# Altium schematic sheet power.SchDoc
size A
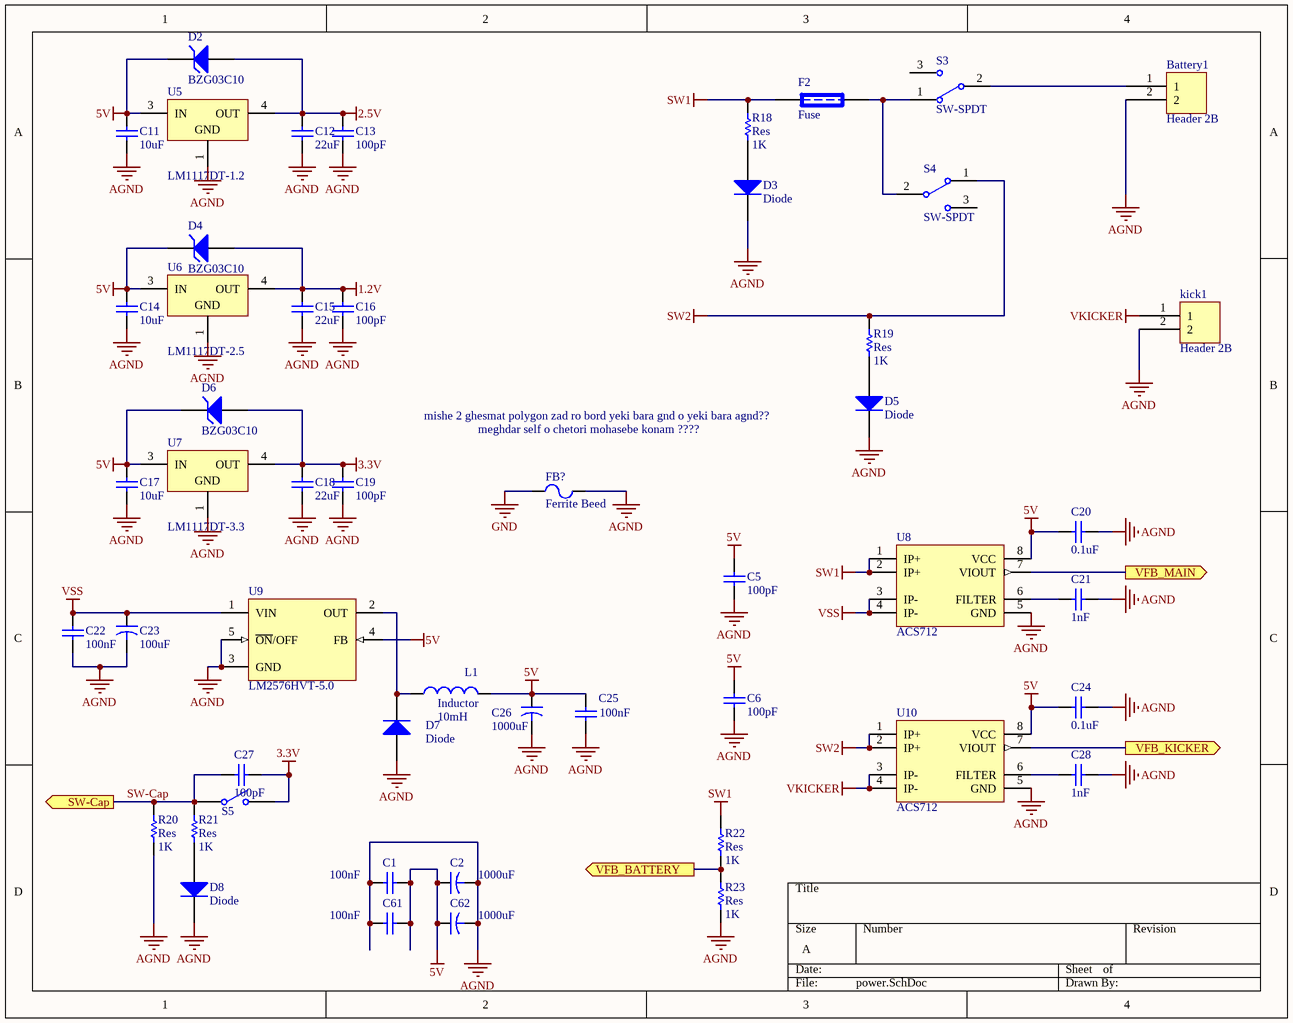
[diagram p0: power.SchDoc]

## Parts
Battery1  Header 2B  [BHDR1X2]
C1  value 100nF  [2012[0805]]  (hidden comment: Cap_UP)
C2  value 1000uF  [7343]  (hidden comment: Cap_El)
C5  value 100pF  [2012[0805]]  (hidden comment: Cap_UP)
C6  value 100pF  [2012[0805]]  (hidden comment: Cap_UP)
C11  value 10uF  [2012[0805]]  (hidden comment: Cap_UP)
C12  value 22uF  [2012[0805]]  (hidden comment: Cap_UP)
C13  value 100pF  [2012[0805]]  (hidden comment: Cap_UP)
C14  value 10uF  [2012[0805]]  (hidden comment: Cap_UP)
C15  value 22uF  [2012[0805]]  (hidden comment: Cap_UP)
C16  value 100pF  [2012[0805]]  (hidden comment: Cap_UP)
C17  value 10uF  [2012[0805]]  (hidden comment: Cap_UP)
C18  value 22uF  [2012[0805]]  (hidden comment: Cap_UP)
C19  value 100pF  [2012[0805]]  (hidden comment: Cap_UP)
C20  value 0.1uF  [2012[0805]]  (hidden comment: Cap_UP)
C21  value 1nF  [2012[0805]]  (hidden comment: Cap_UP)
C22  value 100nF  [2012[0805]]  (hidden comment: Cap_UP)
C23  value 100uF  [Cap1000u-16]  (hidden comment: Cap_El)
C24  value 0.1uF  [2012[0805]]  (hidden comment: Cap_UP)
C25  value 100nF  [2012[0805]]  (hidden comment: Cap_UP)
C26  value 1000uF  [7343]  (hidden comment: Cap_El)
C27  value 100pF  [2012[0805]]  (hidden comment: Cap_UP)
C28  value 1nF  [2012[0805]]  (hidden comment: Cap_UP)
C61  value 100nF  [2012[0805]]  (hidden comment: Cap_UP)
C62  value 1000uF  [7343]  (hidden comment: Cap_El)
D2  BZG03C10  [DO214]
D3  Diode  [2012[0805]]
D4  BZG03C10  [DO214]
D5  Diode  [2012[0805]]
D6  BZG03C10  [DO214]
D7  Diode  [US1M]
D8  Diode  [2012[0805]]
F2  Fuse  [fuse kh]
FB?  Ferrite Beed  [7343]
kick1  Header 2B  [BHDR1X2]
L1  Inductor  value 10mH  [inductor]
R18  Res  value 1K  [2012[0805]]
R19  Res  value 1K  [2012[0805]]
R20  Res  value 1K  [2012[0805]]
R21  Res  value 1K  [2012[0805]]
R22  Res  value 1K  [2012[0805]]
R23  Res  value 1K  [2012[0805]]
S3  SW-SPDT  [KEYKHRAB]
S4  SW-SPDT  [KEYKHRAB]
S5  SW-SPST  [push button B]  (value not drawn)
U5  LM1117DT-1.2  [SOT223]
U6  LM1117DT-2.5  [SOT223]
U7  LM1117DT-3.3  [SOT223]
U8  ACS712  [8 pin SOIC_N]
U9  LM2576HVT-5.0  [T05A]
U10  ACS712  [8 pin SOIC_N]

## Ports
SW-Cap (out), VFB_BATTERY (out), VFB_KICKER (out), VFB_MAIN (out)

## Nets
1.2V: C15.2 C16.2 D4.1(A) U6.4(OUT)
2.5V: C12.2 C13.2 D2.1(A) U5.4(OUT)
3.3V: C18.2 C19.2 C27.2 D6.1(A) S5.2(NO) U7.4(OUT)
5V: C1.2 C2.1 C5.2 C6.2 C11.2 C14.2 C17.2 C20.1 C24.1 C25.2 C26.1 C61.2 C62.1 D2.2(K) D4.2(K) D6.2(K) L1.2 U5.3(IN) U6.3(IN) U7.3(IN) U8.8(VCC) U9.4(FB) U10.8(VCC)
AGND: Battery1.2 C1.1 C2.2 C5.1 C6.1 C11.1 C12.1 C13.1 C14.1 C15.1 C16.1 C17.1 C18.1 C19.1 C20.2 C21.2 C22.1 C23.2 C24.2 C25.1 C26.2 C28.2 C61.1 C62.2 D3.2(K) D5.2(K) D7.1(A) D8.2(K) FB?.2 kick1.2 R20.1 R23.1 U5.1(GND) U6.1(GND) U7.1(GND) U8.5(GND) U9.3(GND) U9.5(~{ON}/OFF) U10.5(GND)
GND: FB?.1
SW1: F2.1 R18.2 R22.2 U8.1(IP+) U8.2(IP+)
SW2: R19.2 S4.1 U10.1(IP+) U10.2(IP+)
VKICKER: kick1.1 U10.3(IP-) U10.4(IP-)
VSS: C22.2 C23.1 U8.3(IP-) U8.4(IP-) U9.1(VIN)
SW-Cap: C27.1 R20.2 R21.2 S5.1(COMMON) ; port SW-Cap
VFB_BATTERY: R22.1 R23.2 ; port VFB_BATTERY
VFB_KICKER: U10.7(VIOUT) ; port VFB_KICKER
VFB_MAIN: U8.7(VIOUT) ; port VFB_MAIN
NetBattery1_1: Battery1.1 S3.2
NetC21_1: C21.1 U8.6(FILTER)
NetC28_1: C28.1 U10.6(FILTER)
NetD3_1: D3.1(A) R18.1
NetD5_1: D5.1(A) R19.1
NetD7_2: D7.2(K) L1.1 U9.2(OUT)
NetD8_1: D8.1(A) R21.1
NetF2_2: F2.2 S3.1 S4.2

Not connected (* = marked no-connect by the designer): S3 3(1); S4 3(1)

## Notes on the sheet
- (near D5) mishe 2 ghesmat polygon zad ro bord yeki bara gnd o yeki bara agnd??
- meghdar self o chetori mohasebe konam ????

## Library data of the parts
C1 C5 C6 C11-C22 C24 C25 C27 C28 C61 = Cap_UP: Capacitor; Published: 8-Jun-2000; LatestRevisionDate: 17-Jul-2002; LatestRevisionNote: Re-released for DXP Platform.; PackageReference: RAD-0.3; Publisher: Altium Limited
C2 C23 C26 C62 = Cap_El: Capacitor; Published: 23-Sep-2002; PackageReference: CAPR5-4X5; Publisher: Altium Limited
D2 D4 D6 = BZG03C10: Silicon Zener Diode (3W); Published: 8-Jun-2000; LatestRevisionDate: 17-Jul-2002; LatestRevisionNote: Re-released for DXP Platform.; DatasheetDocument: 1-Apr-1999; PackageDocument: Apr-1999; PackageReference: DO214; Publisher: Altium Limited; ComponentLink1Description: Manufacturer Link; ComponentLink1URL: http://www.vishay.com/; ComponentLink2Description: Datasheet; ComponentLink2URL: http://www.vishay.com/docs/85593/85593.pdf
D3 D5 D7 D8 = Diode: 1 Amp General Purpose Rectifier; Revision 1: 11-Jul-2000: SIM Model Added.; Revision 2: 17-Jul-2002: Re-released for DXP Platform.; Package Information: Latest Revision: Aug-1999; Code - JEDEC: DO-204-AL; Published: 8-Jun-2000; Datasheet: Latest Revision: 1998; Package Reference: DO-41; Publisher: Altium Limited
FB? = Ferrite Beed: Code_IEC: 1005; Published: 8-Jun-2000; LatestRevisionDate: 17-Jul-2002; LatestRevisionNote: Re-released for DXP Platform.; PackageReference: 0402-A; Publisher: Altium Limited; Code_JEITA: 0402
L1 = Inductor: Code_IEC: 1005; Published: 8-Jun-2000; LatestRevisionDate: 17-Jul-2002; LatestRevisionNote: Re-released for DXP Platform.; PackageReference: 0402-A; Publisher: Altium Limited; Code_JEITA: 0402
R18-R23 = Res: Semiconductor Resistor; Published: 8-Jun-2000; LatestRevisionDate: 17-Jul-2002; LatestRevisionNote: Re-released for DXP Platform.; PackageReference: AXIAL-0.5; Publisher: Altium Limited
S3 S4 = SW-SPDT: SPDT Subminiature Toggle Switch, Right Angle Mounting, Vertical Actuation; Published: 24-Mar-1999; LatestRevisionDate: 17-Dec-2003; LatestRevisionNote: Schematic revised, PCB Footprint replaced.; DatasheetDocument: 05-Dec-2000; PackageReference: TL36WW15050; Publisher: Altium Limited; ComponentLink1Description: Manufacturer Link; ComponentLink1URL: http://www.apem.com
S5 = SW-SPST: Single-Pole, Single-Throw Switch; Published: 24-Mar-1999; Revision: July-2002: Re-released for DXP Platform.; Publisher: Altium Limited
U5-U7 = LM1117DT-3.3: 800mA Low-Dropout Linear Regulator, 3-pin TO-252; Manufacturer: National Semiconductor; PackageTopMarking: NSUZXYTT*LM1117*DT-3.3; PowerWise: N; CompType: LDO IC; Published: 4-Dec-2008; DatasheetVersion: Apr-2006; PackageVersion: revD, Feb-2009; PackageReference: TD03B; Publisher: Altium Limited; PackageDescription: TO252, Molded, Jedec, 6.8 x 6.10 x 2.30mm Body, 3 Lead, 2.28mm Pitch, Surface Mount; Supplier 1: Farnell; Supplier Part Number 1: 9486275; Supplier 2: Farnell; Supplier Part Number 2: 1523829; PartNumber: LM1117DT-3.3; RoHS: N; PinCount: 3; Code_JEDEC: TO-252-AA; ComponentLink1Description: LM1117 Datasheet; ComponentLink1URL: http://www.national.com/ds/LM/LM1117.pdf; ComponentLink2Description: LM1117 Web Page; ComponentLink2URL: http://www.national.com/pf/LM/LM1117.html; ComponentLink3Description: TD03B Package Page; ComponentLink3URL: http://www.national.com/packaging/folders/td03b.html
U9 = LM2576HVT-5.0: SIMPLE SWITCHER; 3A Step-Down Voltage Regulator; Manufacturer: National Semiconductor; PackageTopMarking: NSUZXYTT*LM2576HVT*-5.0 P+; Published: 27-Nov-2008; DatasheetVersion: Aug-2004; PackageVersion: revJ, Jan-1992; PackageReference: T05A; Publisher: Altium Limited; PackageDescription: TO-220, Molded, 5 Lead, Straight; CompType: Switcher; PartNumber: LM2576HVT-5.0; RoHS: O; PinCount: 5; DigiKeyPartNumber: LM2576HVT-5.0-ND; Code_JEDEC: TO-220-AB; ComponentLink1Description: LM2576HV Datasheet; ComponentLink1URL: http://www.national.com/ds/LM/LM2576HV.pdf; ComponentLink2Description: LM2576HV Web Page; ComponentLink2URL: http://www.national.com/pf/LM/LM2576HV.html; ComponentLink3Description: T05A Package Page; ComponentLink3URL: http://www.national.com/packaging/folders/t05a.html
F2 = Fuse: Published: 8-Jun-2000; LatestRevisionDate: 17-Jul-2002; LatestRevisionNote: Re-released for DXP Platform.; PackageReference: PIN-W2/E2.8; Publisher: Altium Limited